# Altium schematic sheet display.SchDoc
size A
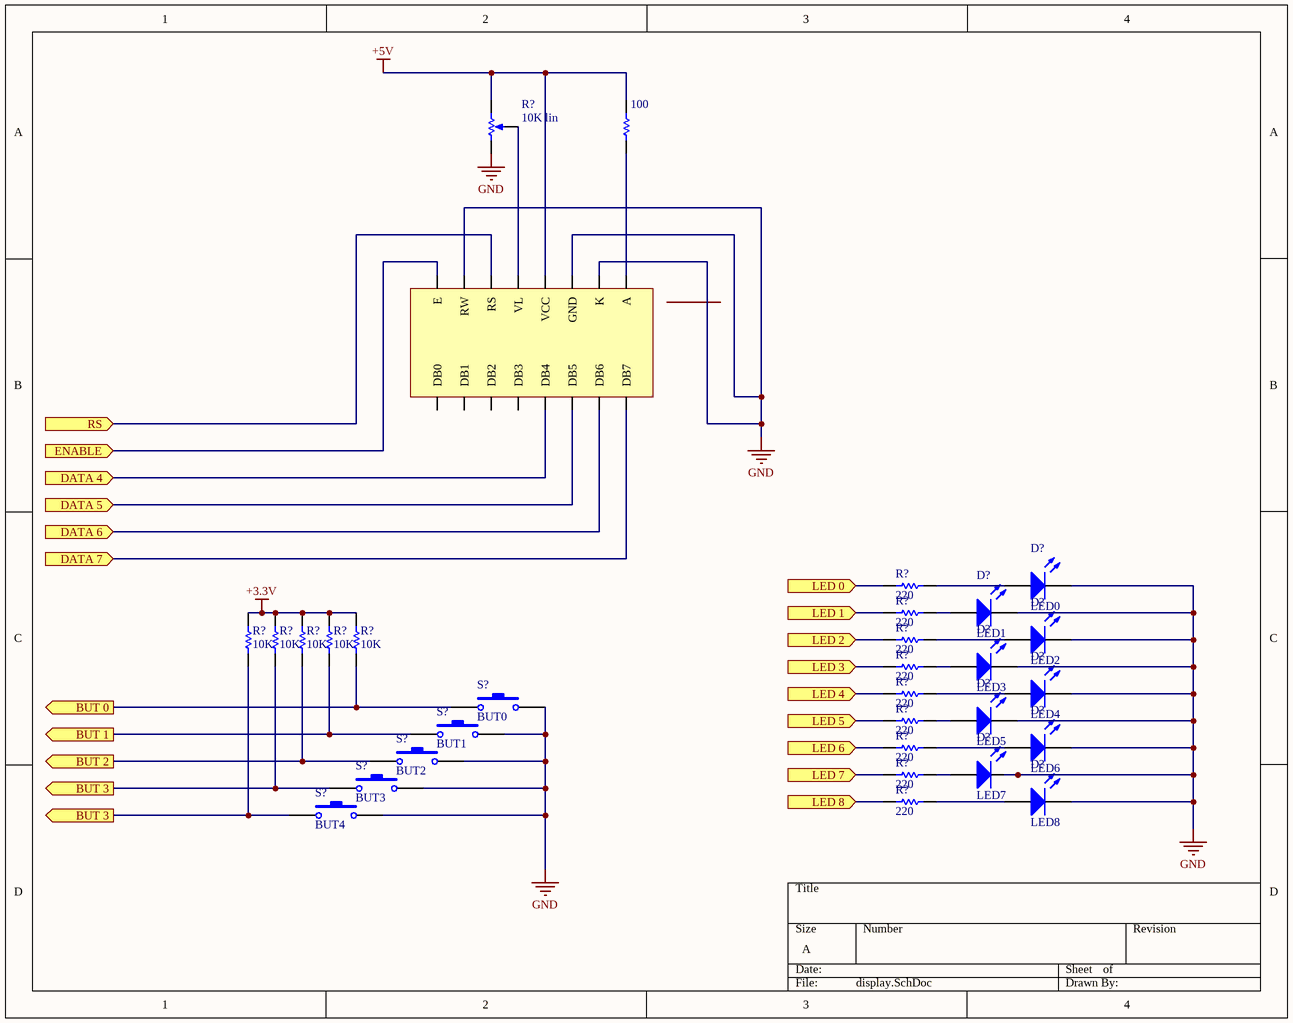
[diagram p0: display.SchDoc]

## Parts
(Parts that share a designator on the sheet are numbered #1, #2 ... from top to bottom, then left to right.)
*  16x2 LCD  (value not drawn)
D?#1  LED0  [LED-0]
D?#2  LED1  [LED-0]
D?#3  LED2  [LED-0]
D?#4  LED3  [LED-0]
D?#5  LED4  [LED-0]
D?#6  LED5  [LED-0]
D?#7  LED6  [LED-0]
D?#8  LED7  [LED-0]
D?#9  LED8  [LED-0]
R?#1  10K lin  [VR5]
R?#2  100  [AXIAL-0.3]
R?#3  220  [AXIAL-0.3]
R?#4  220  [AXIAL-0.3]
R?#5  220  [AXIAL-0.3]
R?#6  10K  [AXIAL-0.3]
R?#7  10K  [AXIAL-0.3]
R?#8  10K  [AXIAL-0.3]
R?#9  10K  [AXIAL-0.3]
R?#10  10K  [AXIAL-0.3]
R?#11  220  [AXIAL-0.3]
R?#12  220  [AXIAL-0.3]
R?#13  220  [AXIAL-0.3]
R?#14  220  [AXIAL-0.3]
R?#15  220  [AXIAL-0.3]
R?#16  220  [AXIAL-0.3]
S?#1  BUT0  [SPST-2]
S?#2  BUT1  [SPST-2]
S?#3  BUT2  [SPST-2]
S?#4  BUT3  [SPST-2]
S?#5  BUT4  [SPST-2]

## Ports
BUT 0 (out), BUT 1 (out), BUT 2 (out), BUT 3 (out), DATA 4 (in), DATA 5 (in), DATA 6 (in), DATA 7 (in), ENABLE (in), LED 0 (in), LED 1 (in), LED 2 (in), LED 3 (in), LED 4 (in), LED 5 (in), LED 6 (in), LED 7 (in), LED 8 (in), RS (in)

## Nets
+3.3V: R?#6.2 R?#7.2 R?#8.2 R?#9.2 R?#10.2
+5V: *.2(VCC) R?#1.2(BOT) R?#2.2
GND: *.1(GND) *.5(RW) *.16(K) D?#1.2(K) D?#2.2(K) D?#3.2(K) D?#4.2(K) D?#5.2(K) D?#6.2(K) D?#7.2(K) D?#8.2(K) D?#9.2(K) R?#1.1(TOP) S?#1.2 S?#2.2 S?#3.2 S?#4.2 S?#5.2
BUT 0: R?#10.1 S?#1.1 ; port BUT 0
BUT 1: R?#9.1 S?#2.1 ; port BUT 1
BUT 2: R?#8.1 S?#3.1 ; port BUT 2
BUT 3: R?#6.1 R?#7.1 S?#4.1 S?#5.1 ; port BUT 3
DATA 4: *.10(DB4) ; port DATA 4
DATA 5: *.9(DB5) ; port DATA 5
DATA 6: *.8(DB6) ; port DATA 6
DATA 7: *.7(DB7) ; port DATA 7
ENABLE: *.6(E) ; port ENABLE
LED 0: R?#3.1 ; port LED 0
LED 1: R?#4.1 ; port LED 1
LED 2: R?#5.1 ; port LED 2
LED 3: R?#11.1 ; port LED 3
LED 4: R?#12.1 ; port LED 4
LED 5: R?#13.1 ; port LED 5
LED 6: R?#14.1 ; port LED 6
LED 7: R?#15.1 ; port LED 7
LED 8: R?#16.1 ; port LED 8
RS: *.4(RS) ; port RS
Net*_3: *.3(VL) R?#1.3(TAP)
Net*_15: *.15(A) R?#2.1
NetD?#1_1: D?#1.1(A) R?#3.2
NetD?#2_1: D?#2.1(A) R?#4.2
NetD?#3_1: D?#3.1(A) R?#5.2
NetD?#4_1: D?#4.1(A) R?#11.2
NetD?#5_1: D?#5.1(A) R?#12.2
NetD?#6_1: D?#6.1(A) R?#13.2
NetD?#7_1: D?#7.1(A) R?#14.2
NetD?#8_1: D?#8.1(A) R?#15.2
NetD?#9_1: D?#9.1(A) R?#16.2

Not connected (* = marked no-connect by the designer): * 11(DB3) 12(DB2) 13(DB1) 14(DB0)

## Library data of the parts
* = Display
D?#1-D?#9 = LED0: Typical INFRARED GaAs LED; Published: 8-Jun-2000; LatestRevisionDate: 08-Jul-2005; LatestRevisionNote: Mech Layer 1 removed.; PackageReference: LED-0; Publisher: Altium Limited; PackageDescription: LED; 2 Leads
R?#1 = RPot: Potentiometer; Sim Note: Enter the Resistance value and the set point into parameter fields.; Set Position: 0.5; Published: 8-Jun-2000; LatestRevisionDate: 17-Jul-2002; LatestRevisionNote: Re-released for DXP Platform.; PackageReference: VR5; Publisher: Altium Limited; PackageDescription: Variable Resistor, Thru-Hole; 3 Leads; Value: 10K
R?#2-R?#4 R?#6-R?#10 = Res1: Resistor; Value: 1K; Published: 8-Jun-2000; LatestRevisionDate: 17-Jul-2002; LatestRevisionNote: Re-released for DXP Platform.; PackageReference: AXIAL-0.3; Publisher: Altium Limited; PackageDescription: Axial Device, Thru-Hole; 2 Leads; 0.3 in Pin Spacing
R?#5 R?#11-R?#16 = Res1: Resistor; Published: 8-Jun-2000; LatestRevisionDate: 17-Jul-2002; LatestRevisionNote: Re-released for DXP Platform.; PackageReference: AXIAL-0.3; Publisher: Altium Limited; PackageDescription: Axial Device, Thru-Hole; 2 Leads; 0.3 in Pin Spacing; Value: 220
S?#1-S?#5 = SW-PB: Switch; Published: 24-Mar-1999; LatestRevisionDate: 17-Jul-2002; LatestRevisionNote: Re-released for DXP Platform.; PackageReference: SPST-2; Publisher: Altium Limited; PackageDescription: Switch; 2 Leads